# Altium schematic sheet Power_Supply.SchDoc: Power Supply
size A4; Author: Yifei Li; DocumentNumber: 1; SheetNumber: 1; SheetTotal: 6
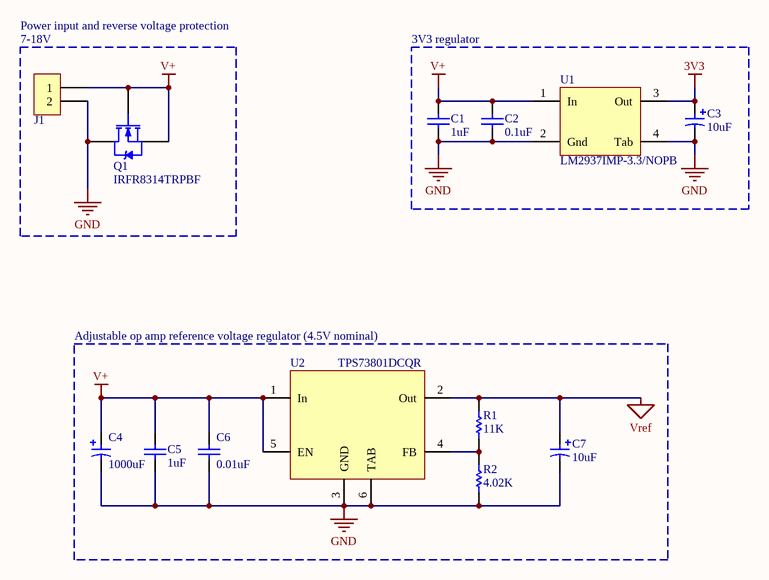
[diagram p0: Power_Supply.SchDoc]

## Parts
C1  1uF  [CAPC1608X09N]
C2  0.1uF  [CAPC1608X09N]
C3  10uF  [CAPMP3216X18N]
C4  1000uF  [Nichicon UVZ 5mm]
C5  1uF  [CAPC1608X09N]
C6  0.01uF  [CAPC1608X09N]
C7  10uF  [CAPMP3216X18N]
J1  TERMINAL BLOCK 2POS  [TERMINAL BLOCK 5MM 2POS]  (value not drawn)
Q1  IRFR8314TRPBF  [DPAK229P991X239-3N]
R1  11K  [RESC1608X06N]
R2  4.02K  [RESC1608X06N]
U1  LM2937IMP-3.3/NOPB  [SOT230P700X180-4N (DCY)]
U2  TPS73801DCQR  [SOT127P705X180-6M (DCQ)]

## Blocks framed on the sheet
3V3 regulator: C1-C3 U1
Adjustable op amp reference voltage regulator (4.5V nominal): C4-C7 R1 R2 U2

## Nets
3V3: C3.1 U1.3(Out)
GND: C1.2 C2.1 C3.2 C4.2 C5.2 C6.1 C7.2 J1.2 Q1.4(D) R2.1 U1.2(Gnd) U1.4(Tab) U2.3(GND) U2.6(TAB)
V+: C1.1 C2.2 C4.1 C5.1 C6.2 J1.1 Q1.1(G) Q1.3(S) U1.1(In) U2.1(In) U2.5(EN)
Vref: C7.1 R1.2 U2.2(Out)
NetR1_1: R1.1 R2.2 U2.4(FB)

## Notes on the sheet
- Power input and reverse voltage protection
- (near J1) 7-18V

## Library data of the parts
C1 C5 = CAP CER 1uF 0603: Manufacturer: Murata; Manufacturer Part Number: GRM188R7YA105KA12D; Voltage: 35V; Rating: X7R; Tolerance: 10%; Value: 1uF; Digikey Part Number: 490-10487-1-ND
C2 = CAP CER 0.1uF 0603: Voltage: 50V; Rating: X7R; Tolerance: 10%; Value: 0.1uF; Digikey Part Number: 490-1519-1-ND; Package: 0603
C3 C7 = CAP TANT 10uF 1.8 OHM 10V 1206: Voltage: 10V; Tolerance: 10%; ESR: 1.8 Ohm; Digikey Part Number: 399-8431-1-ND; Value: 10uF
C4 = CAP ALUM 1000uF SMD: Input Bulk Cap; Manufacturer: Nichicon; Voltage: 25V; Tolerance: 20%; Digikey Part Number: 493-1305-ND; Value: 1000uF
C6 = CAP CER 0.01uF 0603: Manufacturer: Murata; Rating: C0G; Value: 0.01uF; Digikey Part Number: 490-9666-1-ND
Q1 = MOSFET_N_CH_30V_179A_D2PAK: Reverse Voltage Power MOSFET; Manufacturer: Infineon Technologies; VDS: 30V; Rds On (Max): 2.2 mOhm @ 90A, 10V; Digikey Part Number: IRFR8314TRPBFCT-ND; Value: IRFR8314TRPBF
R1 = RES 11K 0603: Manufacturer: Yageo; Manufacturer Part Number: RC0603FR-0711KL; Tolerance: 1%; Power: 0.1W; Type: RES; Footprint: 0603; Temperature: 155dC; Digikey Part Number: 311-11.0KHRCT-ND; Value: 11K
R2 = RES 4.02K 0603: Tolerance: 1%; Type: RES; Footprint: 0603; Value: 4.02K; Digikey Part Number: 311-4.02KHRCT-ND
U2 = TPS73801DCQR: Adjustable 1.21V-20V 1A Regulator; Digikey Part Number: 296-39489-1-ND; Value: TPS73801DCQR
J1 = TERMINAL BLOCK 2POS: Digikey Part Number: ED2561-ND
U1 = LM2937IMP-3.3/NOPB: Digikey Part Number: LM2937IMP-3.3/NOPBCT-ND